# EAGLE schematic audio_board (EAGLE 6.3)

## Sheet 1 of 6: BT module
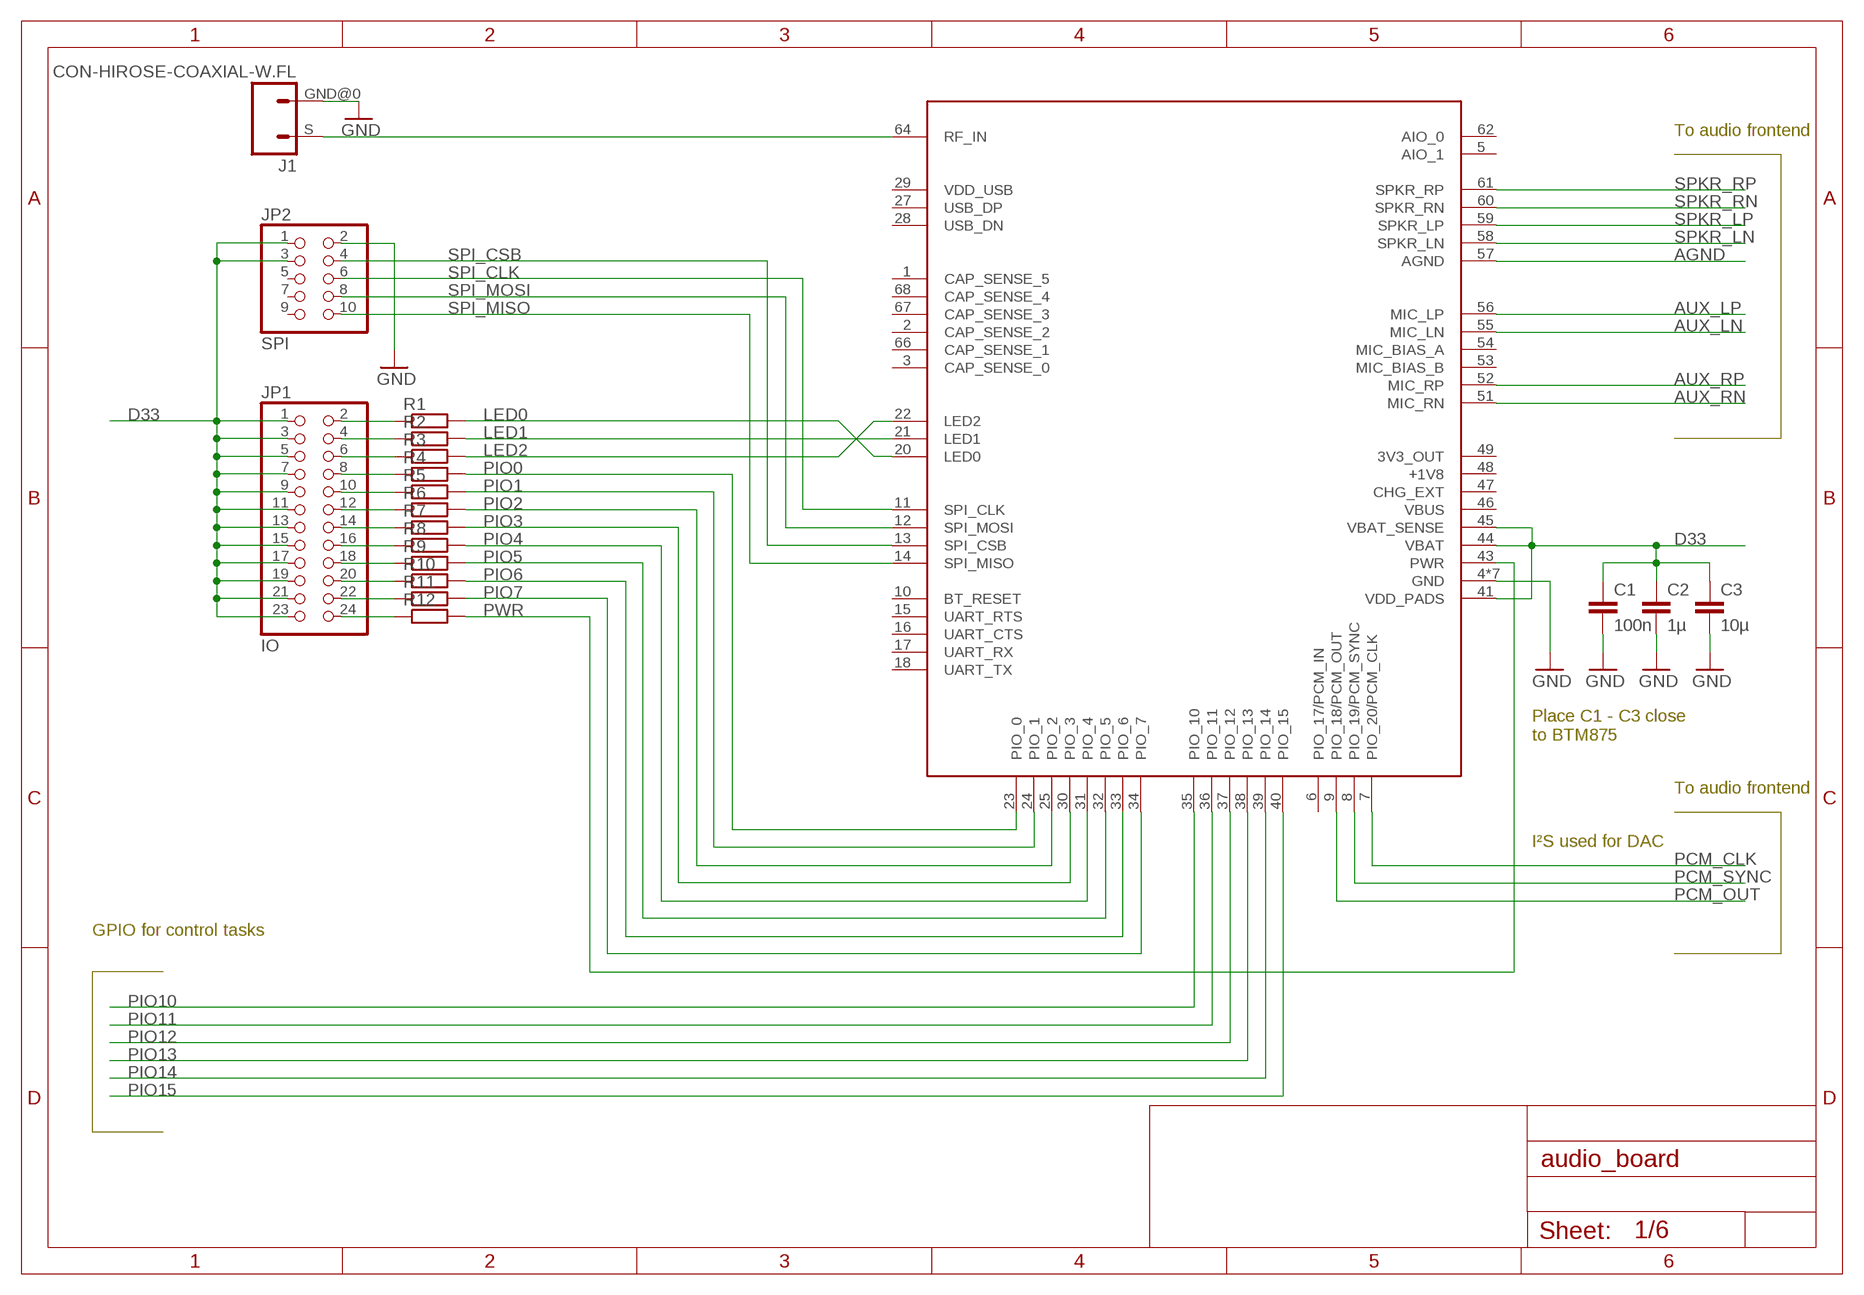
[diagram p0: schematic, sheet 1]

### Parts
BT1  BTM875-B  [BTM875]
C1  100n  C-EUC0805  [C0805]
C2  1µ  C-EUC0805  [C0805]
C3  10µ  C-EUC0805  [C0805]
J1  CON-HIROSE-COAXIAL-W.FL  [CON-W.FL]
JP1  IO  PINHD-2X12  [2X12]
JP2  SPI  PINHD-2X5  [2X05]
R1  R-EU_R0805  [R0805]
R2  R-EU_R0805  [R0805]
R3  R-EU_R0805  [R0805]
R4  R-EU_R0805  [R0805]
R5  R-EU_R0805  [R0805]
R6  R-EU_R0805  [R0805]
R7  R-EU_R0805  [R0805]
R8  R-EU_R0805  [R0805]
R9  R-EU_R0805  [R0805]
R10  R-EU_R0805  [R0805]
R11  R-EU_R0805  [R0805]
R12  R-EU_R0805  [R0805]

### Nets
AGND: BT1.57(AGND)
AUX_LN: BT1.55(MIC_LN) ; also sheet 3
AUX_LP: BT1.56(MIC_LP) ; also sheet 3
AUX_RN: BT1.51(MIC_RN) ; also sheet 3
AUX_RP: BT1.52(MIC_RP) ; also sheet 3
D33: BT1.41(VDD_PADS) BT1.44(VBAT) BT1.45(VBAT_SENSE) C1.1 C2.1 C3.1 JP1.1 JP1.3 JP1.5 JP1.7 JP1.9 JP1.11 JP1.13 JP1.15 JP1.17 JP1.19 JP1.21 JP1.23 JP2.1 JP2.3 ; also sheet 3,5,6
GND: BT1.4(GND) BT1.19(GND) BT1.26(GND) BT1.42(GND) BT1.50(GND) BT1.63(GND) BT1.65(GND) C1.2 C2.2 C3.2 J1.GND@0 JP2.2 ; also sheet 2,3,4,5,6
LED0: BT1.20(LED0) R1.2
LED1: BT1.21(LED1) R2.2
LED2: BT1.22(LED2) R3.2
N$1: BT1.64(RF_IN) J1.S
N$2: JP1.2 R1.1
N$3: JP1.4 R2.1
N$4: JP1.6 R3.1
N$5: JP1.8 R4.1
N$6: JP1.10 R5.1
N$7: JP1.12 R6.1
N$8: JP1.14 R7.1
N$9: JP1.16 R8.1
N$10: JP1.18 R9.1
N$11: JP1.20 R10.1
N$12: JP1.22 R11.1
N$13: JP1.24 R12.1
PCM_CLK: BT1.7(PIO_20/PCM_CLK) ; also sheet 2
PCM_OUT: BT1.9(PIO_18/PCM_OUT) ; also sheet 2
PCM_SYNC: BT1.8(PIO_19/PCM_SYNC) ; also sheet 2
PIO0: BT1.23(PIO_0) R4.2
PIO1: BT1.24(PIO_1) R5.2
PIO2: BT1.25(PIO_2) R6.2
PIO3: BT1.30(PIO_3) R7.2
PIO4: BT1.31(PIO_4) R8.2
PIO5: BT1.32(PIO_5) R9.2
PIO6: BT1.33(PIO_6) R10.2
PIO7: BT1.34(PIO_7) R11.2
PIO10: BT1.35(PIO_10) ; also sheet 3
PIO11: BT1.36(PIO_11) ; also sheet 4
PIO12: BT1.37(PIO_12) ; also sheet 5
PIO13: BT1.38(PIO_13)
PIO14: BT1.39(PIO_14)
PIO15: BT1.40(PIO_15) ; also sheet 2
PWR: BT1.43(PWR) R12.2
SPI_CLK: BT1.11(SPI_CLK) JP2.6
SPI_CSB: BT1.13(SPI_CSB) JP2.4
SPI_MISO: BT1.14(SPI_MISO) JP2.10
SPI_MOSI: BT1.12(SPI_MOSI) JP2.8
SPKR_LN: BT1.58(SPKR_LN) ; also sheet 3
SPKR_LP: BT1.59(SPKR_LP) ; also sheet 3,6
SPKR_RN: BT1.60(SPKR_RN) ; also sheet 3
SPKR_RP: BT1.61(SPKR_RP) ; also sheet 3
Unconnected: BT1.1(CAP_SENSE_5) BT1.2(CAP_SENSE_2) BT1.3(CAP_SENSE_0) BT1.5(AIO_1) BT1.6(PIO_17/PCM_IN) BT1.10(BT_RESET) BT1.15(UART_RTS) BT1.16(UART_CTS) BT1.17(UART_RX) BT1.18(UART_TX) BT1.27(USB_DP) BT1.28(USB_DN) BT1.29(VDD_USB) BT1.46(VBUS) BT1.47(CHG_EXT) BT1.48(+1V8) BT1.49(3V3_OUT) BT1.53(MIC_BIAS_B) BT1.54(MIC_BIAS_A) BT1.62(AIO_0) BT1.66(CAP_SENSE_1) BT1.67(CAP_SENSE_3) BT1.68(CAP_SENSE_4) JP2.5 JP2.7 JP2.9

### Notes on the sheet
- To audio frontend
- Place C1 - C3 close
  to BTM875
- To audio frontend
- I²S used for DAC
- GPIO for control tasks

## Sheet 2 of 6: Subwoofer DAC
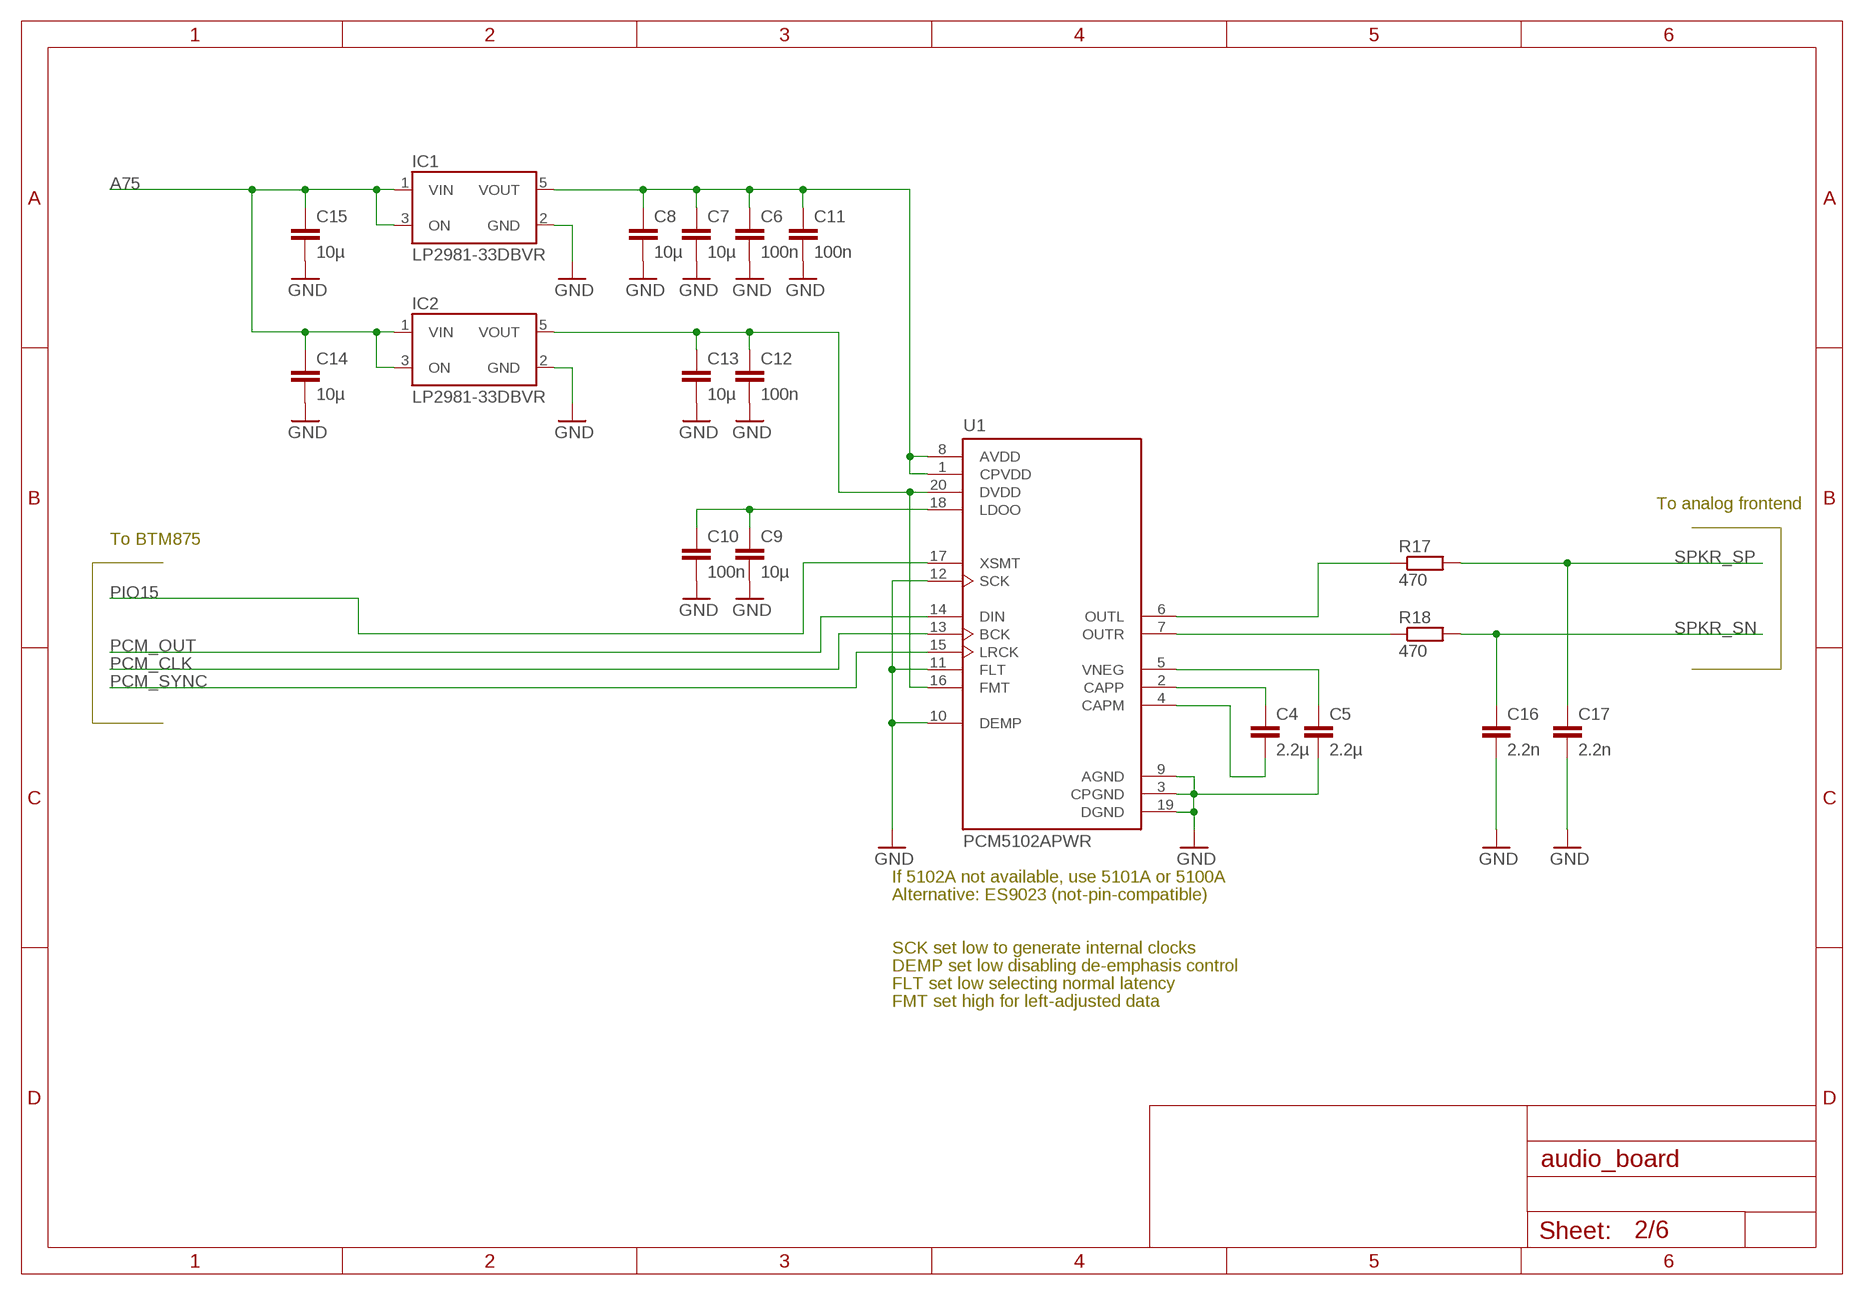
[diagram p1: schematic, sheet 2]

### Parts
C4  2.2µ  C-EUC0805  [C0805]
C5  2.2µ  C-EUC0805  [C0805]
C6  100n  C-EUC0805  [C0805]
C7  10µ  C-EUC0805  [C0805]
C8  10µ  C-EUC0805  [C0805]
C9  10µ  C-EUC0805  [C0805]
C10  100n  C-EUC0805  [C0805]
C11  100n  C-EUC0805  [C0805]
C12  100n  C-EUC0805  [C0805]
C13  10µ  C-EUC0805  [C0805]
C14  10µ  C-EUC0805  [C0805]
C15  10µ  C-EUC0805  [C0805]
C16  2.2n  C-EUC0805  [C0805]
C17  2.2n  C-EUC0805  [C0805]
IC1  LP2981-33DBVR  LP2981M5  [SOT23-5]
IC2  LP2981-33DBVR  LP2981M5  [SOT23-5]
R17  470  R-EU_M0805  [M0805]
R18  470  R-EU_M0805  [M0805]
U1  PCM5102APWR  [SOP65P640X120-20N]

### Nets
A33DAC: C6.1 C7.1 C8.1 C11.1 IC1.5(VOUT) U1.1(CPVDD) U1.8(AVDD)
A75: C14.1 C15.1 IC1.1(VIN) IC1.3(ON) IC2.1(VIN) IC2.3(ON) ; also sheet 3,5,6
D33DAC: C12.1 C13.1 IC2.5(VOUT) U1.16(FMT) U1.20(DVDD)
GND: C5.2 C6.2 C7.2 C8.2 C9.2 C10.2 C11.2 C12.2 C13.2 C14.2 C15.2 C16.2 C17.2 IC1.2(GND) IC2.2(GND) U1.3(CPGND) U1.9(AGND) U1.10(DEMP) U1.11(FLT) U1.12(SCK) U1.19(DGND) ; also sheet 1,3,4,5,6
N$14: C4.1 U1.2(CAPP)
N$15: C4.2 U1.4(CAPM)
N$16: C5.1 U1.5(VNEG)
N$18: C9.1 C10.1 U1.18(LDOO)
N$20: R18.1 U1.7(OUTR)
N$25: R17.1 U1.6(OUTL)
PCM_CLK: U1.13(BCK) ; also sheet 1
PCM_OUT: U1.14(DIN) ; also sheet 1
PCM_SYNC: U1.15(LRCK) ; also sheet 1
PIO15: U1.17(XSMT) ; also sheet 1
SPKR_SN: C16.1 R18.2 ; also sheet 3
SPKR_SP: C17.1 R17.2 ; also sheet 3

### Notes on the sheet
- To analog frontend
- To BTM875
- If 5102A not available, use 5101A or 5100A
- Alternative: ES9023 (not-pin-compatible)
- SCK set low to generate internal clocks
- DEMP set low disabling de-emphasis control
- FLT set low selecting normal latency
- FMT set high for left-adjusted data

## Sheet 3 of 6: Analogue Frontend
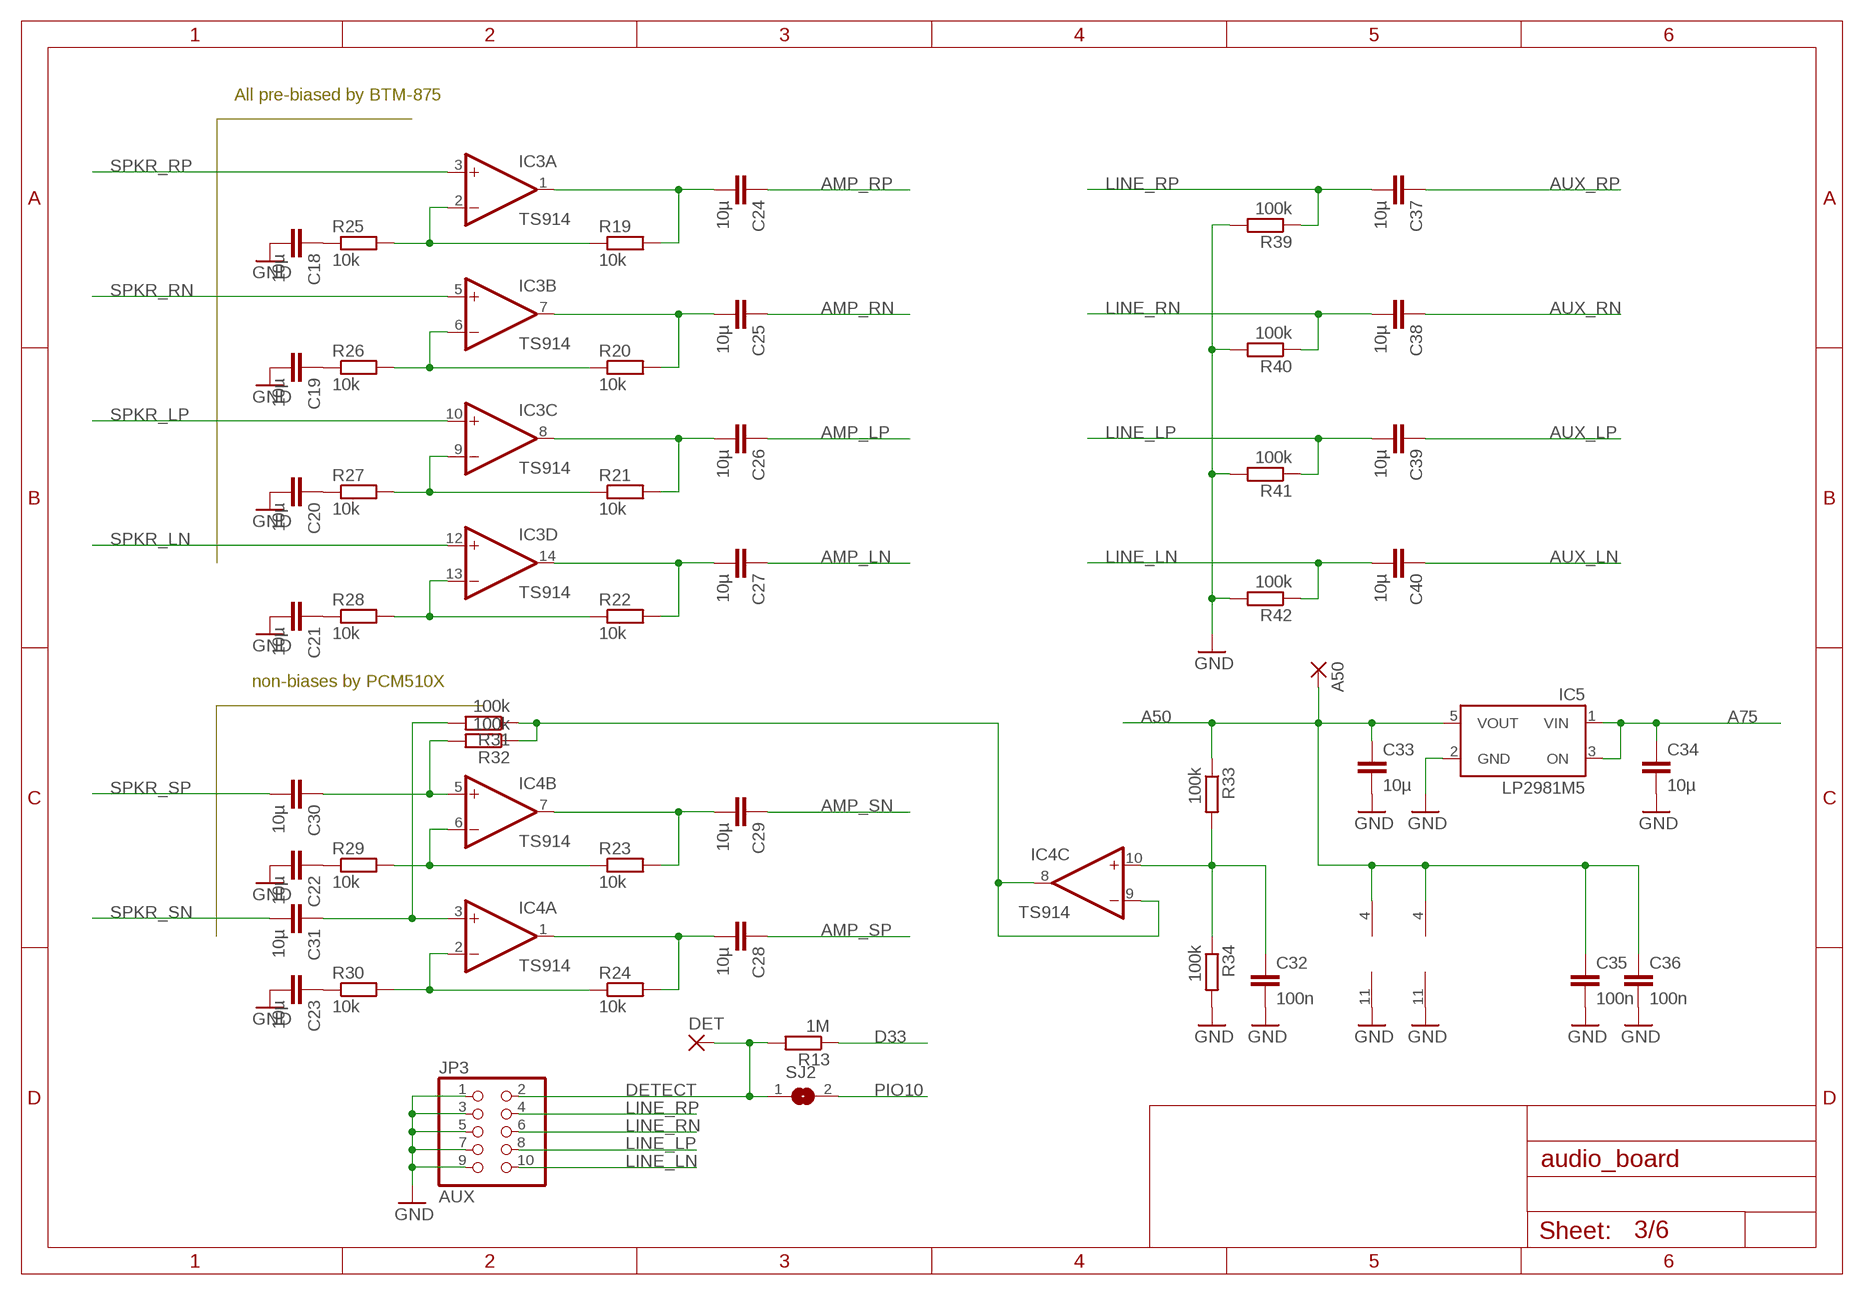
[diagram p2: schematic, sheet 3]

### Parts
A50  SMD2  [SMD1,27-2,54]
C18  10µ  C-EUC0805  [C0805]
C19  10µ  C-EUC0805  [C0805]
C20  10µ  C-EUC0805  [C0805]
C21  10µ  C-EUC0805  [C0805]
C22  10µ  C-EUC0805  [C0805]
C23  10µ  C-EUC0805  [C0805]
C24  10µ  C-EUC0805  [C0805]
C25  10µ  C-EUC0805  [C0805]
C26  10µ  C-EUC0805  [C0805]
C27  10µ  C-EUC0805  [C0805]
C28  10µ  C-EUC0805  [C0805]
C29  10µ  C-EUC0805  [C0805]
C30  10µ  C-EUC0805  [C0805]
C31  10µ  C-EUC0805  [C0805]
C32  100n  C-EUC0805  [C0805]
C33  10µ  C-EUC0805  [C0805]
C34  10µ  C-EUC0805  [C0805]
C35  100n  C-EUC0805  [C0805]
C36  100n  C-EUC0805  [C0805]
C37  10µ  C-EUC0805  [C0805]
C38  10µ  C-EUC0805  [C0805]
C39  10µ  C-EUC0805  [C0805]
C40  10µ  C-EUC0805  [C0805]
DET  SMD2  [SMD1,27-2,54]
IC3  TS914  LM324D  [SO14]
IC4  TS914  LM324D  [SO14]
IC5  LP2981M5  [SOT23-5]
JP3  AUX  PINHD-2X5  [2X05]
R13  1M  R-EU_R0805  [R0805]
R19  10k  R-EU_R0805  [R0805]
R20  10k  R-EU_R0805  [R0805]
R21  10k  R-EU_R0805  [R0805]
R22  10k  R-EU_R0805  [R0805]
R23  10k  R-EU_R0805  [R0805]
R24  10k  R-EU_R0805  [R0805]
R25  10k  R-EU_R0805  [R0805]
R26  10k  R-EU_R0805  [R0805]
R27  10k  R-EU_R0805  [R0805]
R28  10k  R-EU_R0805  [R0805]
R29  10k  R-EU_R0805  [R0805]
R30  10k  R-EU_R0805  [R0805]
R31  100k  R-EU_R0805  [R0805]
R32  100k  R-EU_R0805  [R0805]
R33  100k  R-EU_R0805  [R0805]
R34  100k  R-EU_R0805  [R0805]
R39  100k  R-EU_R0805  [R0805]
R40  100k  R-EU_R0805  [R0805]
R41  100k  R-EU_R0805  [R0805]
R42  100k  R-EU_R0805  [R0805]
SJ2  SJ  [SJ]

### Nets
A25BIAS: IC4.8(C:OUT) IC4.9(C:-IN) R31.1 R32.1
A50: A50.1(P) C33.1 C35.1 C36.1 IC3.4(P:V+) IC4.4(P:V+) IC5.5(VOUT) R33.1 ; also sheet 6
A75: C34.1 IC5.1(VIN) IC5.3(ON) ; also sheet 2,5,6
AMP_LN: C27.1 ; also sheet 4
AMP_LP: C26.1 ; also sheet 4
AMP_RN: C25.1 ; also sheet 4
AMP_RP: C24.1 ; also sheet 4
AMP_SN: C29.1 ; also sheet 4
AMP_SP: C28.1 ; also sheet 4
AUX_LN: C40.1 ; also sheet 1
AUX_LP: C39.1 ; also sheet 1
AUX_RN: C38.1 ; also sheet 1
AUX_RP: C37.1 ; also sheet 1
D33: R13.1 ; also sheet 1,5,6
DETECT: DET.1(P) JP3.2 R13.2 SJ2.1
GND: C18.2 C19.2 C20.2 C21.2 C22.2 C23.2 C32.2 C33.2 C34.2 C35.2 C36.2 IC3.11(P:V-) IC4.11(P:V-) IC5.2(GND) JP3.1 JP3.3 JP3.5 JP3.7 JP3.9 R34.2 R39.2 R40.2 R41.2 R42.2 ; also sheet 1,2,4,5,6
LINE_LN: C40.2 JP3.10 R42.1
LINE_LP: C39.2 JP3.8 R41.1
LINE_RN: C38.2 JP3.6 R40.1
LINE_RP: C37.2 JP3.4 R39.1
N$26: C18.1 R25.1
N$27: C19.1 R26.1
N$28: C20.1 R27.1
N$29: C21.1 R28.1
N$30: C22.1 R29.1
N$31: C23.1 R30.1
N$32: IC4.2(A:-IN) R24.1 R30.2
N$33: IC4.6(B:-IN) R23.1 R29.2
N$34: IC3.13(D:-IN) R22.1 R28.2
N$35: IC3.9(C:-IN) R21.1 R27.2
N$36: IC3.6(B:-IN) R20.1 R26.2
N$37: IC3.2(A:-IN) R19.1 R25.2
N$39: C24.2 IC3.1(A:OUT) R19.2
N$40: C25.2 IC3.7(B:OUT) R20.2
N$41: C26.2 IC3.8(C:OUT) R21.2
N$42: C27.2 IC3.14(D:OUT) R22.2
N$43: C29.2 IC4.7(B:OUT) R23.2
N$44: C28.2 IC4.1(A:OUT) R24.2
N$45: C32.1 IC4.10(C:+IN) R33.2 R34.1
N$46: C31.1 IC4.3(A:+IN) R31.2
N$47: C30.1 IC4.5(B:+IN) R32.2
PIO10: SJ2.2 ; also sheet 1
SPKR_LN: IC3.12(D:+IN) ; also sheet 1
SPKR_LP: IC3.10(C:+IN) ; also sheet 1,6
SPKR_RN: IC3.5(B:+IN) ; also sheet 1
SPKR_RP: IC3.3(A:+IN) ; also sheet 1
SPKR_SN: C31.2 ; also sheet 2
SPKR_SP: C30.2 ; also sheet 2
Unconnected: IC4.12(D:+IN) IC4.13(D:-IN) IC4.14(D:OUT)

### Notes on the sheet
- All pre-biased by BTM-875
- non-biases by PCM510X

## Sheet 4 of 6: Class-D
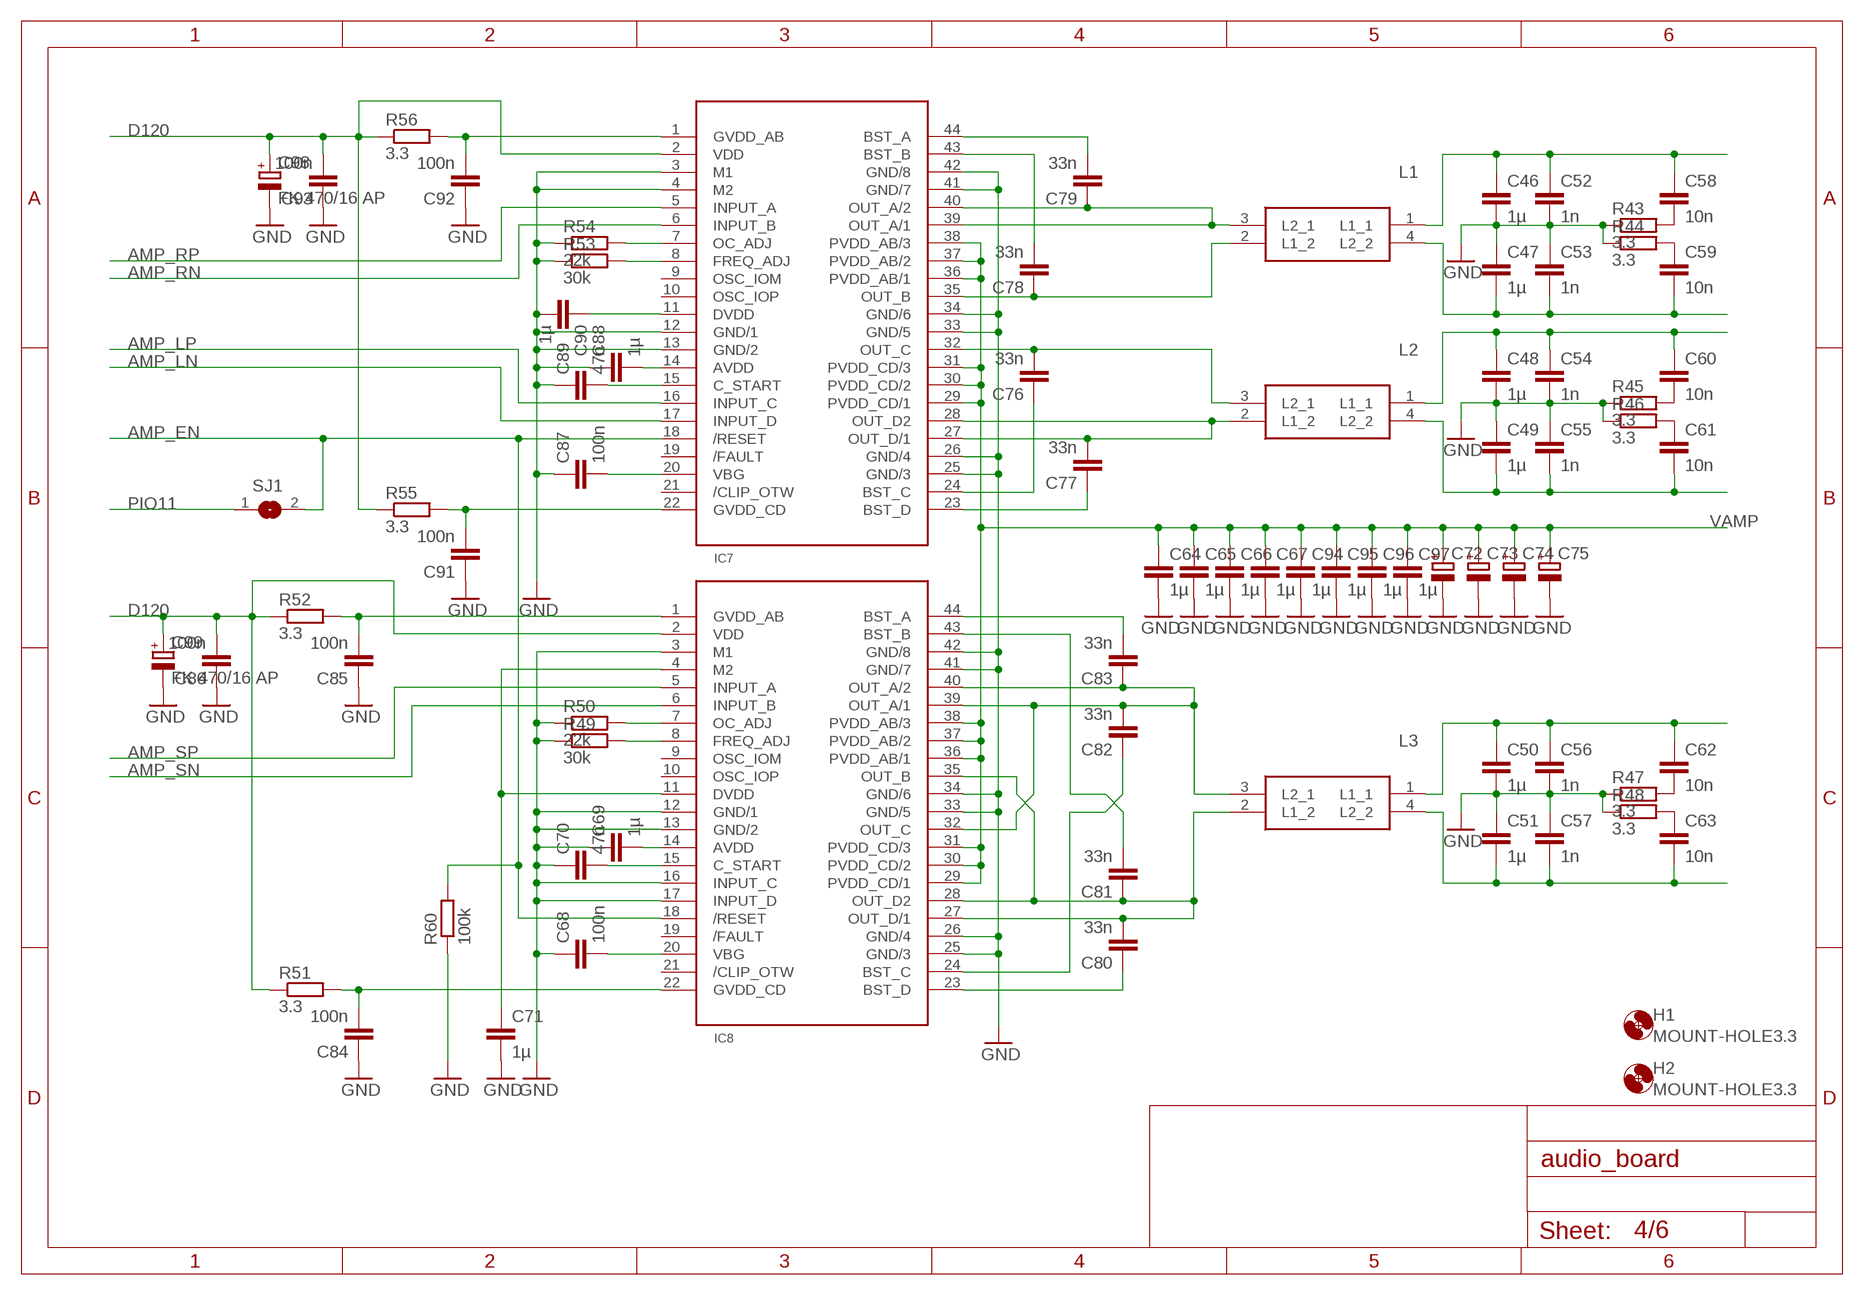
[diagram p3: schematic, sheet 4]

### Parts
C46  1µ  C-EU050-075X075  [C050-075X075]
C47  1µ  C-EU050-075X075  [C050-075X075]
C48  1µ  C-EU050-075X075  [C050-075X075]
C49  1µ  C-EU050-075X075  [C050-075X075]
C50  1µ  C-EU050-075X075  [C050-075X075]
C51  1µ  C-EU050-075X075  [C050-075X075]
C52  1n  C-EUC0805  [C0805]
C53  1n  C-EUC0805  [C0805]
C54  1n  C-EUC0805  [C0805]
C55  1n  C-EUC0805  [C0805]
C56  1n  C-EUC0805  [C0805]
C57  1n  C-EUC0805  [C0805]
C58  10n  C-EUC0805  [C0805]
C59  10n  C-EUC0805  [C0805]
C60  10n  C-EUC0805  [C0805]
C61  10n  C-EUC0805  [C0805]
C62  10n  C-EUC0805  [C0805]
C63  10n  C-EUC0805  [C0805]
C64  1µ  C-EUC0805  [C0805]
C65  1µ  C-EUC0805  [C0805]
C66  1µ  C-EUC0805  [C0805]
C67  1µ  C-EUC0805  [C0805]
C68  100n  C-EUC0805  [C0805]
C69  1µ  C-EUC0805  [C0805]
C70  47n  C-EUC0805  [C0805]
C71  1µ  C-EUC0805  [C0805]
C72  CPOL-EU153CLV-0810  [153CLV-0810]
C73  CPOL-EU153CLV-0810  [153CLV-0810]
C74  CPOL-EU153CLV-0810  [153CLV-0810]
C75  CPOL-EU153CLV-0810  [153CLV-0810]
C76  33n  C-EUC0805  [C0805]
C77  33n  C-EUC0805  [C0805]
C78  33n  C-EUC0805  [C0805]
C79  33n  C-EUC0805  [C0805]
C80  33n  C-EUC0805  [C0805]
C81  33n  C-EUC0805  [C0805]
C82  33n  C-EUC0805  [C0805]
C83  33n  C-EUC0805  [C0805]
C84  100n  C-EUC0805  [C0805]
C85  100n  C-EUC0805  [C0805]
C86  100n  C-EUC0805  [C0805]
C87  100n  C-EUC0805  [C0805]
C88  1µ  C-EUC0805  [C0805]
C89  47n  C-EUC0805  [C0805]
C90  1µ  C-EUC0805  [C0805]
C91  100n  C-EUC0805  [C0805]
C92  100n  C-EUC0805  [C0805]
C93  100n  C-EUC0805  [C0805]
C94  1µ  C-EUC0805  [C0805]
C95  1µ  C-EUC0805  [C0805]
C96  1µ  C-EUC0805  [C0805]
C97  1µ  C-EUC0805  [C0805]
C98  FK 470/16 AP  CPOL-EU153CLV-0810  [153CLV-0810]
C99  FK 470/16 AP  CPOL-EU153CLV-0810  [153CLV-0810]
H1  MOUNT-HOLE3.3  [3,3]
H2  MOUNT-HOLE3.3  [3,3]
IC7  TPA3255  [POWERPAD-TSSOP-44]
IC8  TPA3255  [POWERPAD-TSSOP-44]
L1  UA8014-ALD  [UA8014ALD]
L2  UA8014-ALD  [UA8014ALD]
L3  UA8014-ALD  [UA8014ALD]
R43  3.3  R-EU_R0805  [R0805]
R44  3.3  R-EU_R0805  [R0805]
R45  3.3  R-EU_R0805  [R0805]
R46  3.3  R-EU_R0805  [R0805]
R47  3.3  R-EU_R0805  [R0805]
R48  3.3  R-EU_R0805  [R0805]
R49  30k  R-EU_R0805  [R0805]
R50  22k  R-EU_R0805  [R0805]
R51  3.3  R-EU_R0805  [R0805]
R52  3.3  R-EU_R0805  [R0805]
R53  30k  R-EU_R0805  [R0805]
R54  22k  R-EU_R0805  [R0805]
R55  3.3  R-EU_R0805  [R0805]
R56  3.3  R-EU_R0805  [R0805]
R60  100k  R-EU_R0805  [R0805]
SJ1  SJ  [SJ]

### Nets
AMP_EN: IC7.18(/RESET) IC8.18(/RESET) R60.2 SJ1.2
AMP_LN: IC7.17(INPUT_D) ; also sheet 3
AMP_LP: IC7.16(INPUT_C) ; also sheet 3
AMP_RN: IC7.6(INPUT_B) ; also sheet 3
AMP_RP: IC7.5(INPUT_A) ; also sheet 3
AMP_SN: IC8.6(INPUT_B) ; also sheet 3
AMP_SP: IC8.5(INPUT_A) ; also sheet 3
D120: C86.2 C93.2 C98.+ C99.+ IC7.2(VDD) IC8.2(VDD) R51.1 R52.1 R55.1 R56.1 ; also sheet 5
GND: C46.2 C47.1 C48.2 C49.1 C50.2 C51.1 C52.2 C53.1 C54.2 C55.1 C56.2 C57.1 C64.2 C65.2 C66.2 C67.2 C68.1 C69.1 C70.1 C71.2 C72.- C73.- C74.- C75.- C84.1 C85.1 C86.1 C87.1 C88.1 C89.1 C90.2 C91.1 C92.1 C93.1 C94.2 C95.2 C96.2 C97.2 C98.- C99.- IC7.3(M1) IC7.4(M2) IC7.12(GND/1) IC7.13(GND/2) IC7.25(GND/3) IC7.26(GND/4) IC7.33(GND/5) IC7.34(GND/6) IC7.41(GND/7) IC7.42(GND/8) IC8.3(M1) IC8.12(GND/1) IC8.13(GND/2) IC8.16(INPUT_C) IC8.17(INPUT_D) IC8.25(GND/3) IC8.26(GND/4) IC8.33(GND/5) IC8.34(GND/6) IC8.41(GND/7) IC8.42(GND/8) R43.1 R44.1 R45.1 R46.1 R47.1 R48.1 R49.1 R50.1 R53.1 R54.1 R60.1 ; also sheet 1,2,3,5,6
LN: C49.2 C55.2 C61.2 L2.4(L2_2) ; also sheet 5
LP: C48.1 C54.1 C60.1 L2.1(L1_1) ; also sheet 5
N$17: C79.1 IC7.39(OUT_A/1) IC7.40(OUT_A/2) L1.3(L2_1)
N$19: C78.1 IC7.35(OUT_B) L1.2(L1_2)
N$38: C77.2 IC7.27(OUT_D/1) IC7.28(OUT_D2) L2.2(L1_2)
N$52: C76.2 IC7.32(OUT_C) L2.3(L2_1)
N$57: C58.2 R43.2
N$58: C59.1 R44.2
N$59: C60.2 R45.2
N$60: C61.1 R46.2
N$61: C62.2 R47.2
N$62: C63.1 R48.2
N$65: C79.2 IC7.44(BST_A)
N$68: C78.2 IC7.43(BST_B)
N$72: C76.1 IC7.24(BST_C)
N$73: C71.1 IC8.4(M2) IC8.11(DVDD)
N$74: IC8.7(OC_ADJ) R50.2
N$75: C77.1 IC7.23(BST_D)
N$76: C82.2 C83.1 IC8.32(OUT_C) IC8.39(OUT_A/1) IC8.40(OUT_A/2) L3.3(L2_1)
N$77: C80.2 C81.1 IC8.27(OUT_D/1) IC8.28(OUT_D2) IC8.35(OUT_B) L3.2(L1_2)
N$78: C83.2 IC8.44(BST_A)
N$79: C80.1 IC8.23(BST_D)
N$80: C82.1 IC8.24(BST_C)
N$81: C81.2 IC8.43(BST_B)
N$82: C68.2 IC8.20(VBG)
N$83: C69.2 IC8.14(AVDD)
N$84: C70.2 IC8.15(C_START)
N$85: IC8.8(FREQ_ADJ) R49.2
N$86: C85.2 IC8.1(GVDD_AB) R52.2
N$87: C84.2 IC8.22(GVDD_CD) R51.2
N$88: C90.1 IC7.11(DVDD)
N$89: C87.2 IC7.20(VBG)
N$90: C88.2 IC7.14(AVDD)
N$91: C89.2 IC7.15(C_START)
N$92: IC7.7(OC_ADJ) R54.2
N$93: IC7.8(FREQ_ADJ) R53.2
N$94: C92.2 IC7.1(GVDD_AB) R56.2
N$95: C91.2 IC7.22(GVDD_CD) R55.2
PIO11: SJ1.1 ; also sheet 1
RN: C47.2 C53.2 C59.2 L1.4(L2_2) ; also sheet 5
RP: C46.1 C52.1 C58.1 L1.1(L1_1) ; also sheet 5
SUBN: C51.2 C57.2 C63.2 L3.4(L2_2) ; also sheet 5
SUBP: C50.1 C56.1 C62.1 L3.1(L1_1) ; also sheet 5
VAMP: C64.1 C65.1 C66.1 C67.1 C72.+ C73.+ C74.+ C75.+ C94.1 C95.1 C96.1 C97.1 IC7.29(PVDD_CD/1) IC7.30(PVDD_CD/2) IC7.31(PVDD_CD/3) IC7.36(PVDD_AB/1) IC7.37(PVDD_AB/2) IC7.38(PVDD_AB/3) IC8.29(PVDD_CD/1) IC8.30(PVDD_CD/2) IC8.31(PVDD_CD/3) IC8.36(PVDD_AB/1) IC8.37(PVDD_AB/2) IC8.38(PVDD_AB/3) ; also sheet 5
Unconnected: IC7.9(OSC_IOM) IC7.10(OSC_IOP) IC7.19(/FAULT) IC7.21(/CLIP_OTW) IC8.9(OSC_IOM) IC8.10(OSC_IOP) IC8.19(/FAULT) IC8.21(/CLIP_OTW)

## Sheet 5 of 6: IO Section
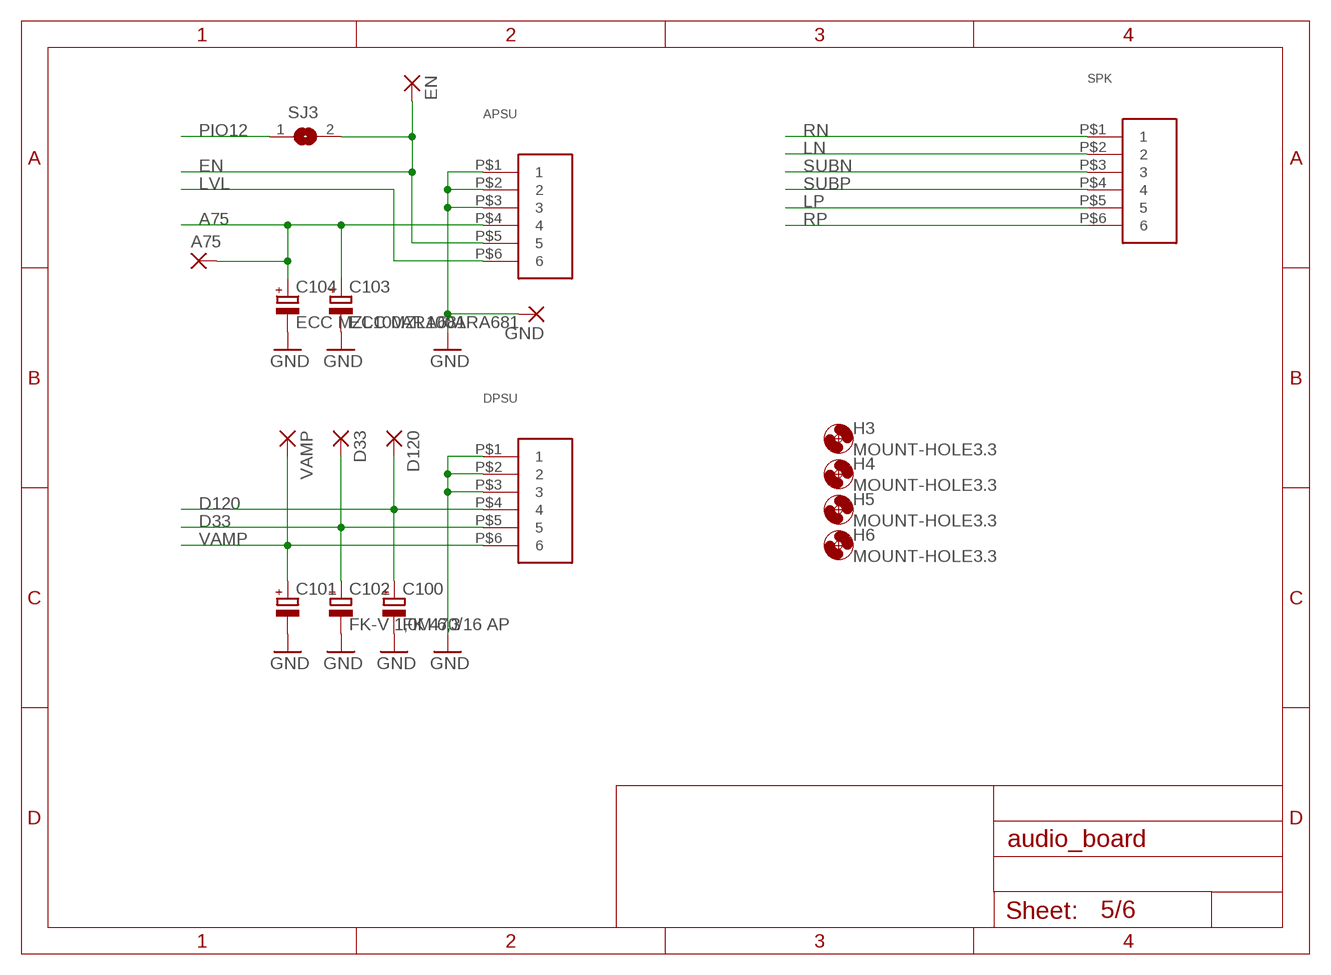
[diagram p4: schematic, sheet 5]

### Parts
A75  SMD2  [SMD1,27-2,54]
APSU  39-30-1060_BLANK  [5569_6P]
C100  FK 470/16 AP  CPOL-EU153CLV-0810  [153CLV-0810]
C101  CPOL-EU153CLV-0810  [153CLV-0810]
C102  FK-V 1,0M 6,3  CPOL-EU153CLV-0810  [153CLV-0810]
C103  ECC MZL100ARA681  CPOL-EU153CLV-0810  [153CLV-0810]
C104  ECC MZL100ARA681  CPOL-EU153CLV-0810  [153CLV-0810]
D33  SMD2  [SMD1,27-2,54]
D120  SMD2  [SMD1,27-2,54]
DPSU  39-30-1060_BLANK  [5569_6P]
EN  SMD2  [SMD1,27-2,54]
GND  SMD2  [SMD1,27-2,54]
H3  MOUNT-HOLE3.3  [3,3]
H4  MOUNT-HOLE3.3  [3,3]
H5  MOUNT-HOLE3.3  [3,3]
H6  MOUNT-HOLE3.3  [3,3]
SJ3  SJ  [SJ]
SPK  39-30-1060_BLANK  [5569_6P]
VAMP  SMD2  [SMD1,27-2,54]

### Nets
A75: A75.1(P) APSU.P$4 C103.+ C104.+ ; also sheet 2,3,6
D33: C102.+ D33.1(P) DPSU.P$5 ; also sheet 1,3,6
D120: C100.+ D120.1(P) DPSU.P$4 ; also sheet 4
EN: APSU.P$5 EN.1(P) SJ3.2
GND: APSU.P$1 APSU.P$2 APSU.P$3 C100.- C101.- C102.- C103.- C104.- DPSU.P$1 DPSU.P$2 DPSU.P$3 GND.1(P) ; also sheet 1,2,3,4,6
LN: SPK.P$2 ; also sheet 4
LP: SPK.P$5 ; also sheet 4
LVL: APSU.P$6 ; also sheet 6
PIO12: SJ3.1 ; also sheet 1
RN: SPK.P$1 ; also sheet 4
RP: SPK.P$6 ; also sheet 4
SUBN: SPK.P$3 ; also sheet 4
SUBP: SPK.P$4 ; also sheet 4
VAMP: C101.+ DPSU.P$6 VAMP.1(P) ; also sheet 4

## Sheet 6 of 6: LVL Threshold
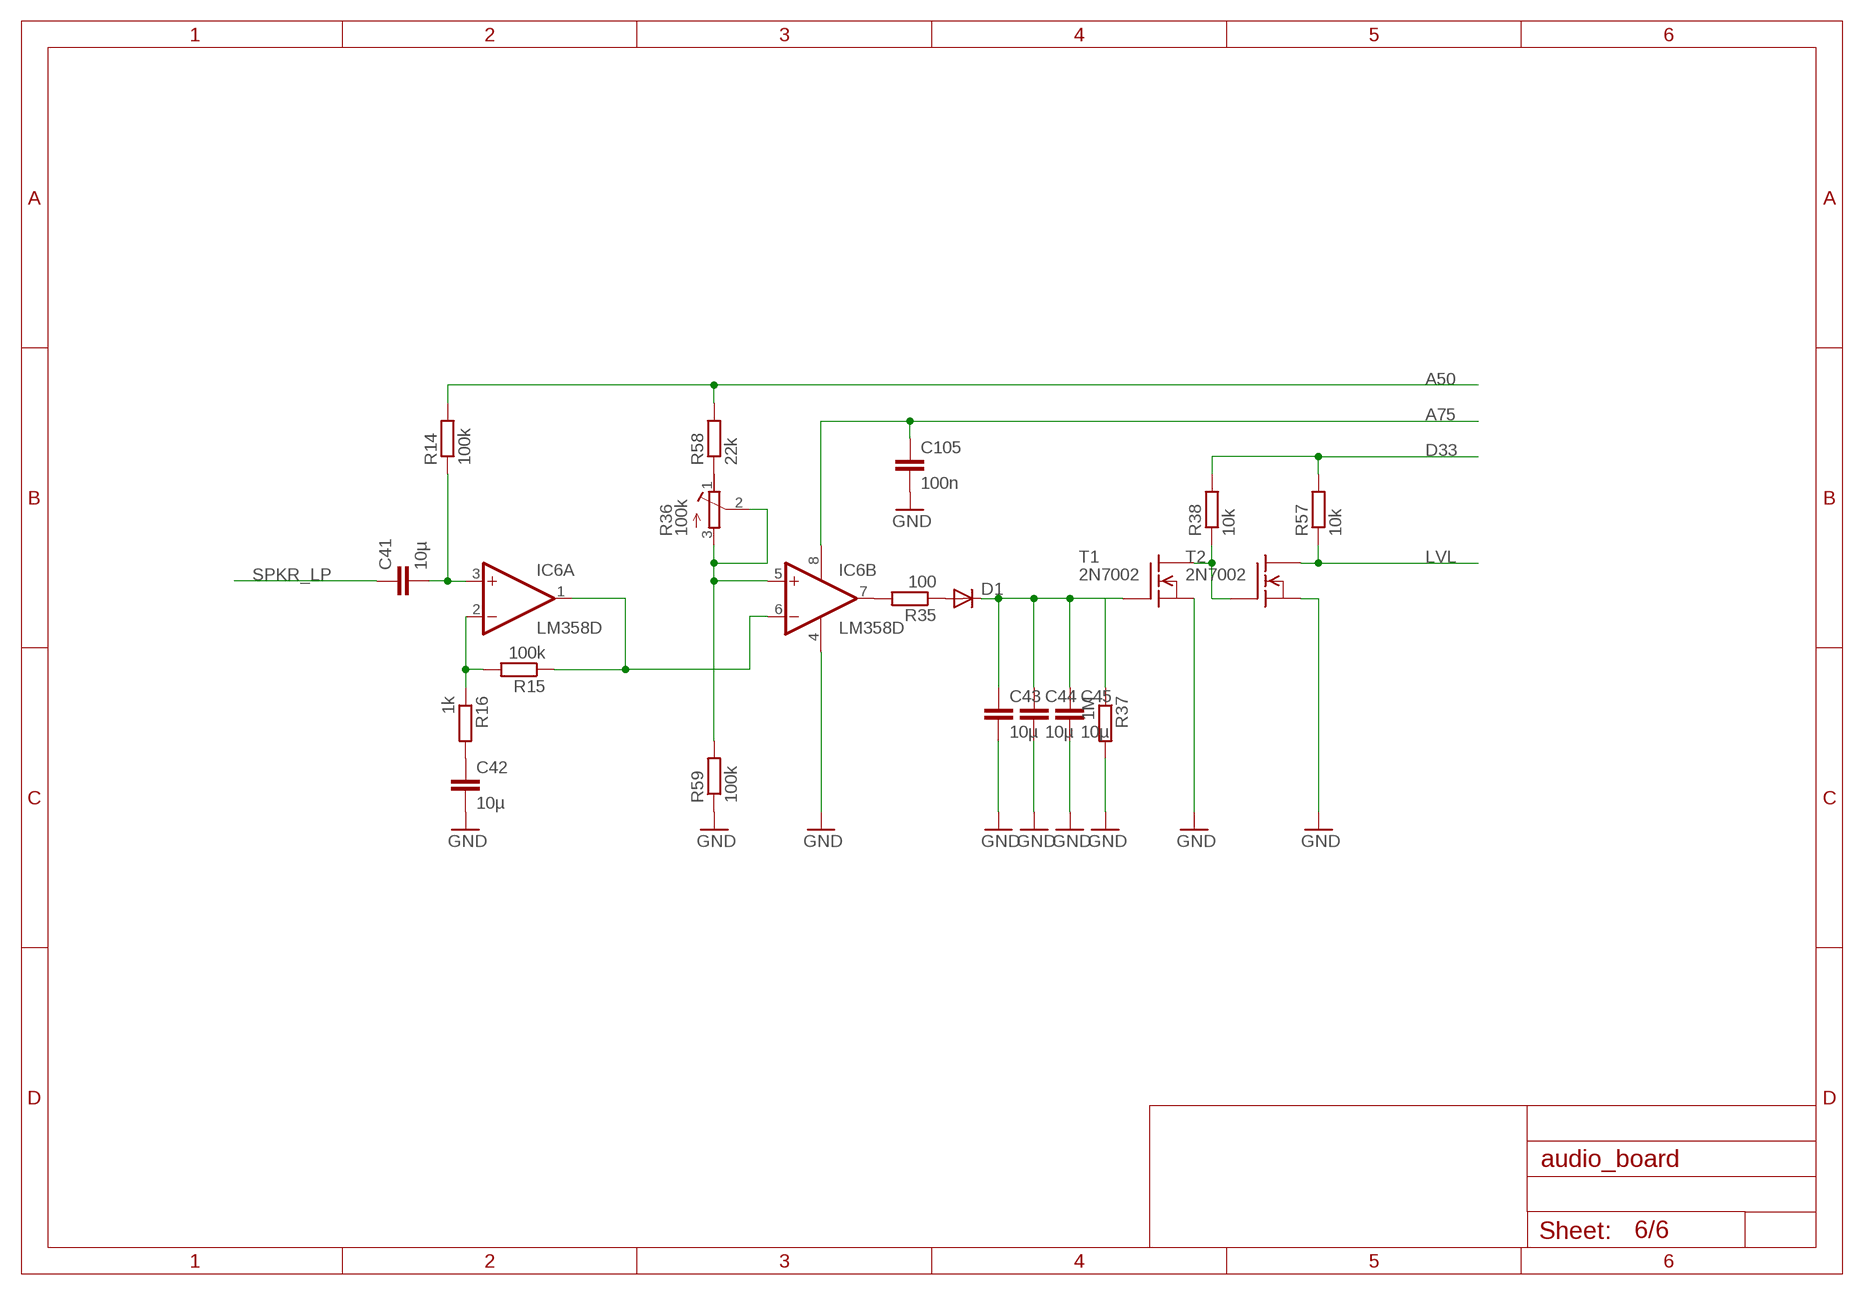
[diagram p5: schematic, sheet 6]

### Parts
C41  10µ  C-EUC0805  [C0805]
C42  10µ  C-EUC0805  [C0805]
C43  10µ  C-EUC0805  [C0805]
C44  10µ  C-EUC0805  [C0805]
C45  10µ  C-EUC0805  [C0805]
C105  100n  C-EUC0805  [C0805]
D1  DIODE-DO214AC  [DO214AC]
IC6  LM358D  [SO08]
R14  100k  R-EU_M0805  [M0805]
R15  100k  R-EU_M0805  [M0805]
R16  1k  R-EU_M0805  [M0805]
R35  100  R-EU_M0805  [M0805]
R36  100k  R-TRIMM3314G  [RTRIM3314G]
R37  1M  R-EU_M0805  [M0805]
R38  10k  R-EU_M0805  [M0805]
R57  10k  R-EU_M0805  [M0805]
R58  22k  R-EU_M0805  [M0805]
R59  100k  R-EU_M0805  [M0805]
T1  2N7002  [SOT23]
T2  2N7002  [SOT23]

### Nets
A50: R14.2 R58.2 ; also sheet 3
A75: C105.1 IC6.8(P:V+) ; also sheet 2,3,5
D33: R38.2 R57.2 ; also sheet 1,3,5
GND: C42.2 C43.2 C44.2 C45.2 C105.2 IC6.4(P:V-) R37.2 R59.1 T1.2(S) T2.2(S) ; also sheet 1,2,3,4,5
LVL: R57.1 T2.3(D) ; also sheet 5
N$21: C41.2 IC6.3(A:+IN) R14.1
N$23: C42.1 R16.2
N$24: IC6.2(A:-IN) R15.2 R16.1
N$48: IC6.1(A:OUT) IC6.6(B:-IN) R15.1
N$49: R38.1 T1.3(D) T2.1(G)
N$50: R36.1(E) R58.1
N$55: IC6.7(B:OUT) R35.2
N$56: D1.A R35.1
N$63: C43.1 C44.1 C45.1 D1.C R37.1 T1.1(G)
N$64: IC6.5(B:+IN) R36.2(S) R36.3(A) R59.2
SPKR_LP: C41.1 ; also sheet 1,3

## Library data of the parts
A50 A75 D33 D120 DET EN GND VAMP = wirepad:SMD2: SMD PAD
APSU DPSU SPK = molex-con-39301060:39-30-1060_BLANK
BT1 = btm875:BTM875-B: Sky Jiarun Technologies introduces the pioneer of the Bluetooth 5.0 modules SJR-BTM875-B which is a high performance, cost effective, low power and compact solution. The Bluetooth module provides a complete 2.4GHz Bluetooth system based on the CSR8675 BGA chipset which is a single chip radio and baseband IC for Bluetooth 2.4GHz systems,. This module is fully qualified single-chip dual mode Bluetooth@v5.0 system; BTM875-B: BTM875-B
C1-C71 C76-C97 C105 = rcl:C-EU: CAPACITOR, European symbol
C72-C75 C98-C104 = rcl:CPOL-EU: POLARIZED CAPACITOR, European symbol
D1 = diode:DIODE-: DIODE
H1-H6 = holes:MOUNT-HOLE: MOUNTING HOLE with drill center marker
IC1 IC2 IC5 = v-reg-3:LP2981: National Semiconductor <http://www.national.com> Micropower Linear Regulator 100mA regulated output, Vin 16V max., ultra-low dropout of 200mV @ 100mA, 1µA standby current
IC3 IC4 = linear:LM324: OP AMP
IC6 = linear:LM358: OP AMP also LM158; LM258; LM2904 Source: http://cache.national.com/ds/LM/LM158.pdf
IC7 IC8 = components:TPA3255; TPA3255: TPA3255
J1 = m-pad-2.1:CON-HIROSE-COAXIAL: Hirose SMT 50 ohm impedance connector W.FL ............................. 1.4mm mated height, ultra small SMT connectors .................................. DC to 3GHz U.FL .............................. 1.9mm or 2.4mm mated height, ultra small SMT connectors ................... DC to 6GHz E.FL ............................... 3.2mm mated height, ultra small SMT connectors .................................. DC to 2GHz H.FL .............................. 3.0mm mated height, ultra small SMT connectors ................................... DC to 3GHz S.FL. ............................. 6.0mm mated height, SMT connectors ................................................... DC to 2.5GHz FL ................................. 10.5mm mated height, SMT connectors .................................................. DC to 1.5GHz Please send any comments to: messi@users.sourceforge.net
JP1 = pinhead:PINHD-2X12: PIN HEADER
JP2 JP3 = pinhead:PINHD-2X5: PIN HEADER
L1-L3 = SamacSys_Parts:UA8014-ALD: Coupled Inductors 10uH 10% 9A 6.6mOhms AEC-Q200 Source: Datasheet <https://www.coilcraft.com/pdfs/ua801x.pdf>; DESCRIPTION: Coupled Inductors 10uH 10% 9A 6.6mOhms AEC-Q200; HEIGHT: 16mm; MANUFACTURER_NAME: COILCRAFT; MANUFACTURER_PART_NUMBER: UA8014-ALD; MOUSER_PART_NUMBER: 994-UA8014-ALD; MOUSER_PRICE-STOCK: https://www.mouser.co.uk/ProductDetail/Coilcraft/UA8014-ALD/?qs=qSfuJ%252Bfl%2Fd4nyyvNNVbELg%3D%3D
R1-R35 R37-R60 = rcl:R-EU_: RESISTOR, European symbol
R36 = rcl:R-TRIMM: Trimm resistor
SJ1-SJ3 = jumper:SJ: SMD solder JUMPER
T1 T2 = parts:2N7002: N-CHANNEL ENHANCEMENT MODE FIELD EFFECT TRANSISTOR
U1 = PCM5102APWR:PCM5102APWR: 2VRMS DirectPath, 112dB Audio Stereo DAC with 32-bit, 384kHz PCM Interface 20-TSSOP -25 to 85 Check prices <https://pricing.snapeda.com/parts/PCM5102APWR/Texas%20Instruments/view-part?ref=eda>; AVAILABILITY: Warning; DESCRIPTION: 2VRMS DirectPath&trade;, 112dB Audio Stereo DAC with 32-bit, 384kHz PCM Interface 20-TSSOP -25 to 85; MF: Texas Instruments; MP: PCM5102APWR; PACKAGE: TSSOP-20 Texas Instruments; PRICE: None; PURCHASE-URL: https://pricing.snapeda.com/search/part/PCM5102APWR/?ref=eda